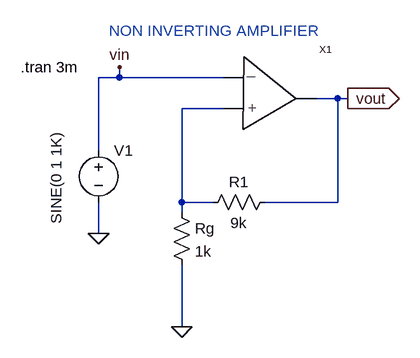
[diagram p0: schematic Non_Inverting_Amplifier_V2.asc]
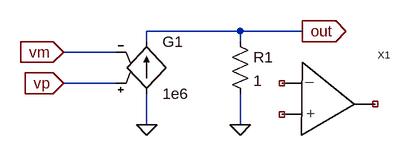
[diagram p1: sub-circuit opamp.asc]
Non_Inverting_Amplifier_V2.asc, the LTspice schematic file:
Version 4
SHEET 1 880 680
WIRE 48 48 48 32
WIRE 48 48 16 48
WIRE 208 48 48 48
WIRE 384 80 352 80
WIRE 400 80 384 80
WIRE 208 96 144 96
WIRE 16 160 16 48
WIRE 144 240 144 96
WIRE 192 240 144 240
WIRE 384 240 384 80
WIRE 384 240 272 240
WIRE 144 256 144 240
WIRE 16 288 16 240
WIRE 144 432 144 336
FLAG 16 288 0
FLAG 400 80 vout
IOPIN 400 80 Out
FLAG 144 432 0
FLAG 48 32 vin
SYMBOL voltage 16 144 R0
WINDOW 3 -65 -12 VRight 2
WINDOW 123 0 0 Left 0
WINDOW 39 0 0 Left 0
SYMATTR Value SINE(0 1 1K)
SYMATTR InstName V1
SYMBOL res 128 240 R0
SYMATTR InstName Rg
SYMATTR Value 1k
SYMBOL res 288 224 R90
WINDOW 0 0 56 VBottom 2
WINDOW 3 32 56 VTop 2
SYMATTR InstName R1
SYMATTR Value 9k
SYMBOL opamp 240 80 R0
SYMATTR InstName X1
TEXT -104 32 Left 2 !.tran 3m
TEXT 32 -24 Left 2 ;NON INVERTING AMPLIFIER

opamp.asc, the sub-circuit schematic file:
Version 4
SHEET 1 880 680
WIRE 336 112 192 112
WIRE 432 112 336 112
WIRE 192 128 192 112
WIRE 336 128 336 112
WIRE 144 144 64 144
WIRE 144 192 64 192
WIRE 192 256 192 208
WIRE 336 256 336 208
FLAG 192 256 0
FLAG 336 256 0
FLAG 64 144 vm
IOPIN 64 144 In
FLAG 64 192 vp
IOPIN 64 192 In
FLAG 432 112 out
IOPIN 432 112 Out
SYMBOL g2 192 112 R0
SYMATTR InstName G1
SYMATTR Value 1e6
SYMBOL res 320 112 R0
SYMATTR InstName R1
SYMATTR Value 1
SYMBOL opamp 432 224 R0
SYMATTR InstName X1

The netlist it stands for:
* Non_Inverting_Amplifier_V2.asc
V1 vin 0 SINE(0 1 1K)
Rg N001 0 1k
R1 vout N001 9k
XX1 vin N001 vout opamp

* block symbol definitions
.subckt opamp vm vp out
G1 0 out vp vm 1e6
R1 out 0 1
XX1 NC_01 NC_02 NC_03 opamp
.ends opamp

.tran 3m
* NON INVERTING AMPLIFIER
.backanno
.end